# Altium schematic sheet Sheet1.SchDoc: Название схемы
size 420 x 297 mm; ApprovedBy: Человек 1; CheckedBy: Человек 3; Author: Человек 2; DrawnBy: Человек; DocumentNumber: АЕСН.ХХХХХХ.ХХХЭ3; SheetNumber: x; SheetTotal: x; DocumentName: Sheet1.SCHDOC
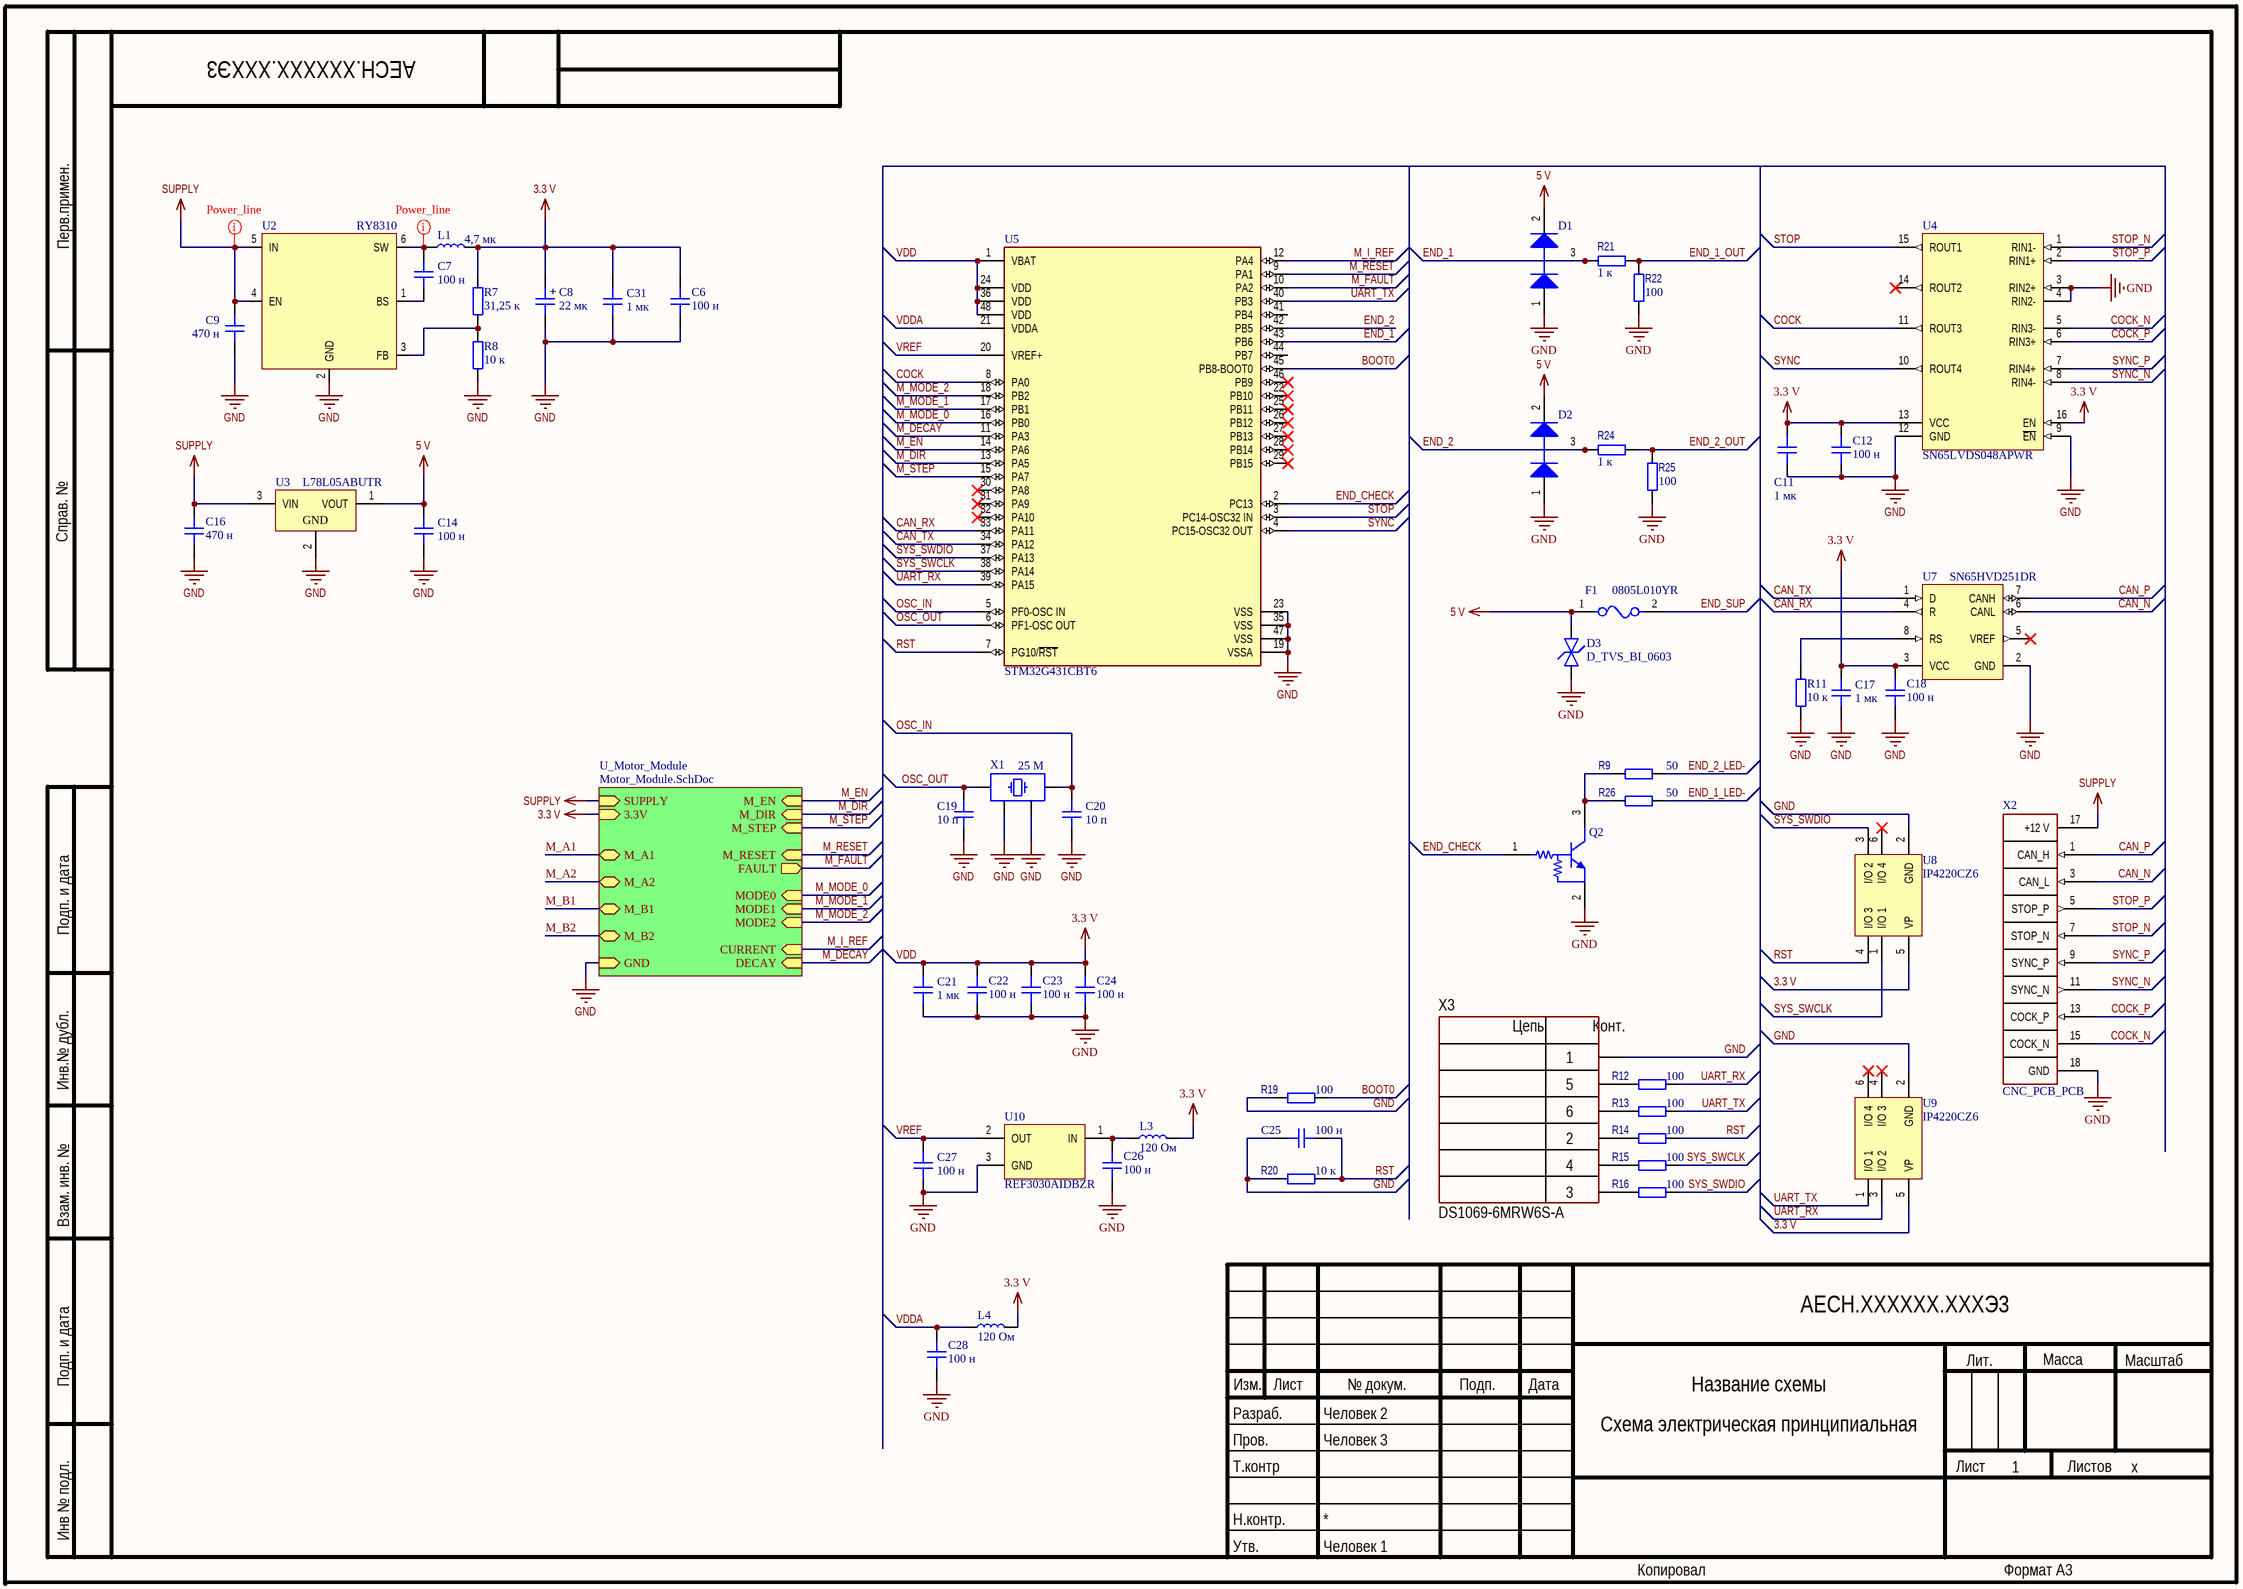
[diagram p0: Sheet1.SchDoc]

## Parts
C6  100 н  [CAP_0603]
C7  100 н  [CAP_0603]
C8  22 мк  [TANTAL_B]
C9  470 н  [CAP_0805]
C11  1 мк  [CAP_0603]
C12  100 н  [CAP_0603]
C14  100 н  [CAP_0603]
C16  470 н  [CAP_0805]
C17  1 мк  [CAP_0603]
C18  100 н  [CAP_0603]
C19  10 п  [CAP_0603]
C20  10 п  [CAP_0603]
C21  1 мк  [CAP_0603]
C22  100 н  [CAP_0603]
C23  100 н  [CAP_0603]
C24  100 н  [CAP_0603]
C25  100 н  [CAP_0603]
C26  100 н  [CAP_0603]
C27  100 н  [CAP_0603]
C28  100 н  [CAP_0603]
C31  1 мк  [CAP_0603]
D1  BAT54AW  [ONSC-SOT-323-3-419-04_V]  (value not drawn)
D2  BAT54AW  [ONSC-SOT-323-3-419-04_V]  (value not drawn)
D3  D_TVS_BI_0603  [D_0603]
F1  0805L010YR  [FP-0805L010-MFG]
L1  4,7 мк  [IND_1008]
L3  120 Ом  [IND_0603]
L4  120 Ом  [IND_0603]
Q2  MMUN2233LT1G  [ONSC-SOT-23-3-318-08_V]  (value not drawn)
R7  31,25 к  [RES_0603]
R8  10 к  [RES_0603]
R9  50  [RES_0603]
R11  10 к  [RES_0603]
R12  100  [RES_0603]
R13  100  [RES_0603]
R14  100  [RES_0603]
R15  100  [RES_0603]
R16  100  [RES_0603]
R19  100  [RES_0603]
R20  10 к  [RES_0603]
R21  1 к  [RES_0603]
R22  100  [RES_0603]
R24  1 к  [RES_0603]
R25  100  [RES_0603]
R26  50  [RES_0603]
U2  RY8310  [SOT-23-6]
U3  L78L05ABUTR  [SOT-89_N]
U4  SN65LVDS048APWR  [MTC16_M]
U5  STM32G431CBT6  [FP-LQFP48-5B-MFG]
U7  SN65HVD251DR  [D0008A_N]
U8  IP4220CZ6  [NXP-SOT457_L]
U9  IP4220CZ6  [NXP-SOT457_L]
U10  REF3030AIDBZR  [DBZ0003A_N]
X1  25 M  [XTAL_3225]
X2  CNC_PCB_PCB  [CNC_PCB_PCB]  (no BOM)
X3  DS1069-6MRW6S-A  [CON: CWF-6R]

## Sub-sheets
U_Motor_Module = Motor_Module.SchDoc: M_A1 (bidir), M_A2 (bidir), M_B1 (bidir), M_B2 (bidir), M_EN (in), M_STEP (in), M_DIR (in), SUPPLY (in), GND (in), M_RESET (in), FAULT (out), MODE0 (in), MODE1 (in), MODE2 (in), CURRENT (in), 3.3V (in), DECAY (in)

## Nets
3.3 V: C6.1 C8.1 C11.2 C12.2 C17.2 C18.1 C21.2 C22.1 C23.1 C24.1 C31.2 L1.2 L3.2 L4.2 R7.1 U4.13(VCC) U4.16(EN) U5.1(VBAT) U5.24(VDD) U5.36(VDD) U5.48(VDD) U7.3(VCC) U8.5(VP) U9.5(VP) ; sheet U_Motor_Module/3.3V  [also labelled VDD]
5 V: C14.2 D1.2(K) D2.2(K) D3.K F1.1 U3.1(VOUT)
GND: C6.2 C8.2 C9.2 C11.1 C12.1 C14.1 C16.2 C17.1 C18.2 C19.2 C20.2 C21.1 C22.2 C23.2 C24.2 C25.1 C26.2 C27.1 C28.2 C31.1 D1.1(A) D2.1(A) D3.A Q2.2(E) R8.2 R11.1 R19.2 R20.2 R22.2 R25.2 U2.2(GND) U3.2(GND) U4.3(RIN2+) U4.4(RIN2-) U4.9(~{EN}) U4.12(GND) U5.19(VSSA) U5.23(VSS) U5.35(VSS) U5.47(VSS) U7.2(GND) U8.2(GND) U9.2(GND) U10.3(GND) X1.2 X1.4 X2.18(GND) X3.1 ; sheet U_Motor_Module/GND
SUPPLY: C9.1 C16.1 U2.4(EN) U2.5(IN) U3.3(VIN) X2.17(+12_V) ; sheet U_Motor_Module/SUPPLY
BOOT0: R19.1 U5.45(PB8-BOOT0)
CAN_N: U7.6(CANL) X2.3(CAN_L)
CAN_P: U7.7(CANH) X2.1(CAN_H)
CAN_RX: U5.33(PA11) U7.4(R)
CAN_TX: U5.34(PA12) U7.1(D)
COCK: U4.11(ROUT3) U5.8(PA0)
COCK_N: U4.5(RIN3-) X2.15(COCK_N)
COCK_P: U4.6(RIN3+) X2.13(COCK_P)
END_1: D1.3(K/A) R21.2 U5.43(PB6)
END_1_LED-: R26.2
END_1_OUT: R21.1 R22.1
END_2: D2.3(K/A) R24.2 U5.42(PB5)
END_2_LED-: R9.2
END_2_OUT: R24.1 R25.1
END_CHECK: Q2.1(B) U5.2(PC13)
END_SUP: F1.2
M_A1: sheet U_Motor_Module/M_A1
M_A2: sheet U_Motor_Module/M_A2
M_B1: sheet U_Motor_Module/M_B1
M_B2: sheet U_Motor_Module/M_B2
M_DECAY: U5.11(PA3) ; sheet U_Motor_Module/DECAY
M_DIR: U5.13(PA5) ; sheet U_Motor_Module/M_DIR
M_EN: U5.14(PA6) ; sheet U_Motor_Module/M_EN
M_FAULT: U5.10(PA2) ; sheet U_Motor_Module/FAULT
M_I_REF: U5.12(PA4) ; sheet U_Motor_Module/CURRENT
M_MODE_0: U5.16(PB0) ; sheet U_Motor_Module/MODE0
M_MODE_1: U5.17(PB1) ; sheet U_Motor_Module/MODE1
M_MODE_2: U5.18(PB2) ; sheet U_Motor_Module/MODE2
M_RESET: U5.9(PA1) ; sheet U_Motor_Module/M_RESET
M_STEP: U5.15(PA7) ; sheet U_Motor_Module/M_STEP
OSC_IN: C20.1 U5.5(PF0-OSC_IN) X1.3
OSC_OUT: C19.1 U5.6(PF1-OSC_OUT) X1.1
RST: C25.2 R14.1 R20.1 U5.7(PG10/~{RST}) U8.4(I/O_3)
STOP: U4.15(ROUT1) U5.3(PC14-OSC32_IN)
STOP_N: U4.1(RIN1-) X2.7(STOP_N)
STOP_P: U4.2(RIN1+) X2.5(STOP_P)
SYNC: U4.10(ROUT4) U5.4(PC15-OSC32_OUT)
SYNC_N: U4.8(RIN4-) X2.11(SYNC_N)
SYNC_P: U4.7(RIN4+) X2.9(SYNC_P)
SYS_SWCLK: R15.1 U5.38(PA14) U8.1(I/O_1)
SYS_SWDIO: R16.1 U5.37(PA13) U8.3(I/O_2)
UART_RX: R12.1 U5.39(PA15) U9.3(I/O_2)
UART_TX: R13.1 U5.40(PB3) U9.1(I/O_1)
VDDA: C28.1 L4.1 U5.21(VDDA)
VREF: C27.2 U5.20(VREF+) U10.2(OUT)
NetC7_1: C7.1 U2.1(BS)
NetC7_2: C7.2 L1.1 U2.6(SW)
NetC26_1: C26.1 L3.1 U10.1(IN)
NetQ2_3: Q2.3(C) R9.1 R26.1
NetR7_2: R7.2 R8.1 U2.3(FB)
NetR11_2: R11.2 U7.8(RS)
NetR12_2: R12.2 X3.5
NetR13_2: R13.2 X3.6
NetR14_2: R14.2 X3.2
NetR15_2: R15.2 X3.4
NetR16_2: R16.2 X3.3

Not connected (* = marked no-connect by the designer): U4 14(ROUT2)*; U5 22(PB10)* 25(PB11)* 26(PB12)* 27(PB13)* 28(PB14)* 29(PB15)* 30(PA8)* 31(PA9)* 32(PA10)* 41(PB4) 44(PB7) 46(PB9)*; U7 5(VREF)*; U8 6(I/O_4)*; U9 4(I/O_3)* 6(I/O_4)*

## Layout directives
net class Power_line: NetC7_2, SUPPLY

## Notes on the sheet
- Перв.примен.
- Справ. №
- Подп. и дата
- Инв.№ дубл.
- Взам. инв. №
- Изм.
- Лист
- № докум.
- Подп.
- Дата
- Лит.
- Масса
- Масштаб
- Пров.
- Т.контр
- Разраб.
- Схема электрическая принципиальная
- 1
- Листов
- Инв № подл.
- Н.контр.
- Утв.
- Копировал
- Формат А3
- (in symbol 6-Connector) Цепь; Конт.
- (in symbol CAP_ALEL_16x16.5_25V) +

## Library data of the parts
C6 C11 C12 C17-C25 C27 C31 = CAP_0603: Керамический конденсатор; Type: CAP_CERAMIC; ChipDip: *; Mount: SMD; Model: *
  C6 C12 C18 C22-C25 C27: Value: 100 н
  C11 C17 C21 C31: Value: 1 мк
  C19 C20: Value: 10 п
C7 C14 = CAP_0805: Керамический конденсатор; Type: CAP_CERAMIC; Value: 100 н; Mount: SMD; Model: *; ChipDip: *
C8 = CAP_ALEL_16x16.5_25V: Танталовый конденсатор; Voltage: 6,3; Type: CAP_TANTALUM; ChipDip: 9000629219; Value: 22 мк; Model: *; Mount: SMD
C9 C16 = CAP_0805: Capacitor SMD 0805; Voltage: 50; Type: CAP_CERAMIC; Value: 470 н; Model: *; ChipDip: *; Mount: *
C26 C28 = CAP_0603: Capacitor SMD 0603; Type: CAP_CERAMIC; Value: 100 н; ChipDip: *; Model: *; Mount: *
D1 D2 = CMP-1055-00559-1: Dual Series Schottky Barrier Diodes, 3-Pin SOT-323, Pb-Free, Tape and Reel; Value: 200 мА; Type: DIODE; ChipDip: 9001634706; ComponentLink1URL: http://www.onsemi.com/; ComponentLink1Description: Manufacturer URL; ComponentLink3URL: http://www.onsemi.com/pub_link/Collateral/419-04.PDF; ComponentLink2URL: http://www.onsemi.cn/pub_link/Collateral/BAT54SWT1-D.PDF; ComponentLink3Description: Package Specification; ComponentLink2Description: Datasheet; Model: BAT54AW; Mount: SMD
D3 = D_TVS_BI_0603: Diode TVS / ESD Bidirectional 0603; Model: *; Mount: *; Value: *; Type: TVS; ChipDip: *
F1 = CMP-00227-00673855-1: 0805L010YR PTC Resettable Fuse 0.1A(hold) 0.3A(trip) 15VDC 100A 0.5W 1.5s 1Ohm SMD Solder Pad 0805 T/R; Value: 100 мА; ChipDip: 9000587472; Model: 0805L010YR; Mount: SMD; Type: FUSE
L1 = IND_1008: Inductor SMD 1008; Type: IND; Value: 4,7 мк; Mount: SMD; ChipDip: *; Model: *
L3 L4 = IND_0603: Inductor SMD 0603; Type: IND_SUP; Value: 120 Ом; Mount: SMD; ChipDip: *; Model: *
Q2 = CMP-0630-00250-1: Digital Transistor (BRT), R1=4.7 kOhm, R2=47 kOhm, NPN Transistor, 3-Pin SOT-23, Pb-Free, Tape and Reel; ChipDip: 8021345115; ComponentLink3Description: Package Specification; ComponentLink1Description: Manufacturer URL; ComponentLink3URL: http://www.onsemi.cn/pub_link/Collateral/318-08.PDF; ComponentLink2URL: http://www.onsemi.cn/pub_link/Collateral/DTC143Z-D.PDF; ComponentLink2Description: Datasheet; ComponentLink1URL: http://www.onsemi.com/; Model: MMUN2233LT1G; Mount: SMD; Value: *; Type: NPN
R7 R8 = RES_0805: Резистор; Type: RESISTOR; Mount: SMD; Model: *; ChipDip: *
  R7: Value: 31,25 к
  R8: Value: 10 к
R9 R11-R16 R19-R22 R24-R26 = RES_0603: Резистор; Type: RESISTOR; ChipDip: *; Mount: SMD; Model: *
  R9 R26: Value: 50
  R11 R20: Value: 10 к
  R12-R16 R19 R22 R25: Value: 100
  R21 R24: Value: 1 к
U2 = MT2492: Понижающий DC-DC; ChipDip: 8026700717; Model: RY8310; Type: IC; Mount: SMD
U3 = CMP-0244-00406-1: Positive Voltage Regulator, 5V, 4-Pin SOT-89, Tape and Reel; Model: 78L05-150; Value: 5 В; ChipDip: 9001231094; ComponentLink2Description: Datasheet; ComponentLink1URL: http://www.st.com; ComponentLink1Description: Manufacturer URL; ComponentLink2URL: http://www.st.com/internet/com/TECHNICAL_RESOURCES/TECHNICAL_LITERATURE/DATASHEET/CD00000446.pdf; Mount: SMD; Type: IC
U4 = CMP-0058-01148-2: Драйвер LVDS; ChipDip: 9001070381; ComponentLink1Description: DS90LV047A Datasheet; ComponentLink1URL: http://www.national.com/ds/DS/DS90LV047A.pdf; ComponentLink2Description: DS90LV047A Web Page; ComponentLink2URL: http://www.national.com/pf/DS/DS90LV047A.html; ComponentLink3Description: MTC16 Package Page; ComponentLink3URL: http://www.national.com/packaging/folders/mtc16.html; Model: SN65LVDS048APWR; Type: IC; Mount: SMD; Value: *
U5 = CMP-12105-000030-1: MAINSTREAM ARM CORTEX-M4+ MCU 17; ChipDip: 9001089797; ComponentLink2Description: Datasheet; ComponentLink2URL: https://www.st.com/resource/en/datasheet/stm32g431cb.pdf; Model: STM32G431CBT6; Mount: SMD; Value: *; Type: IC
U7 = CMP-0315-00074-2: Драйвер CAN; ChipDip: 9000342409; ComponentLink1Description: Datasheet; ComponentLink1URL: http://www.ti.com/general/docs/lit/getliterature.tsp?genericPartNumber=SN65HVD251&fileType=pdf; Type: IC; Model: SN65HVD251DR; Mount: SMD; Value: *
U8 U9 = CMP-2000-06457-1: Сборка защитных диодов; ChipDip: 9001067611; Model: IP4220CZ6; Type: IC; Mount: SMD; Value: *
U10 = CMP-0367-00160-2: 2.048 V, 50 ppm / degC, 50 uA Series (Bandgap) Voltage Reference, -40 to 125 degC, 3-pin SOT-23 (DBZ), Green (RoHS & no Sb/Br); ComponentLink1URL: http://www.ti.com/; ComponentLink3URL: http://www.ti.com/litv/pdf/mpds108a; ComponentLink2URL: http://www.ti.com/general/docs/lit/getliterature.tsp?genericPartNumber=REF3020&fileType=pdf; ComponentLink3Description: Package Specification; ComponentLink4Description: URL Link1; ComponentLink2Description: Datasheet; ComponentLink4URL: Samples URL:http://www.ti.com/product/ref3020; ComponentLink1Description: Manufacturer URL; Model: REF3030AIDBZR; Type: IC; Value: *; Mount: *
X1 = TSX-3225_24.0000MF15X-AC: Кварцевый резонатор; ChipDip: 8026581531; Model: X322525MOB4SI; Value: 25 M; Type: CRYSTAL; Mount: SMD
X2 = CNC_PCB_PCB: pin to pad: 1>1+2 3>3+4 5>5+6 7>7+8 9>9+10 11>11+12 13>13+14 15>15+16; Model: *; ChipDip: *; Mount: *
X3 = 6-Connector: ChipDip: 9000295853; Model: DS1069-6MRW6S-A; Mount: THT; Value: *; Type: CON